# EAGLE design board (EAGLE 6.5.0)
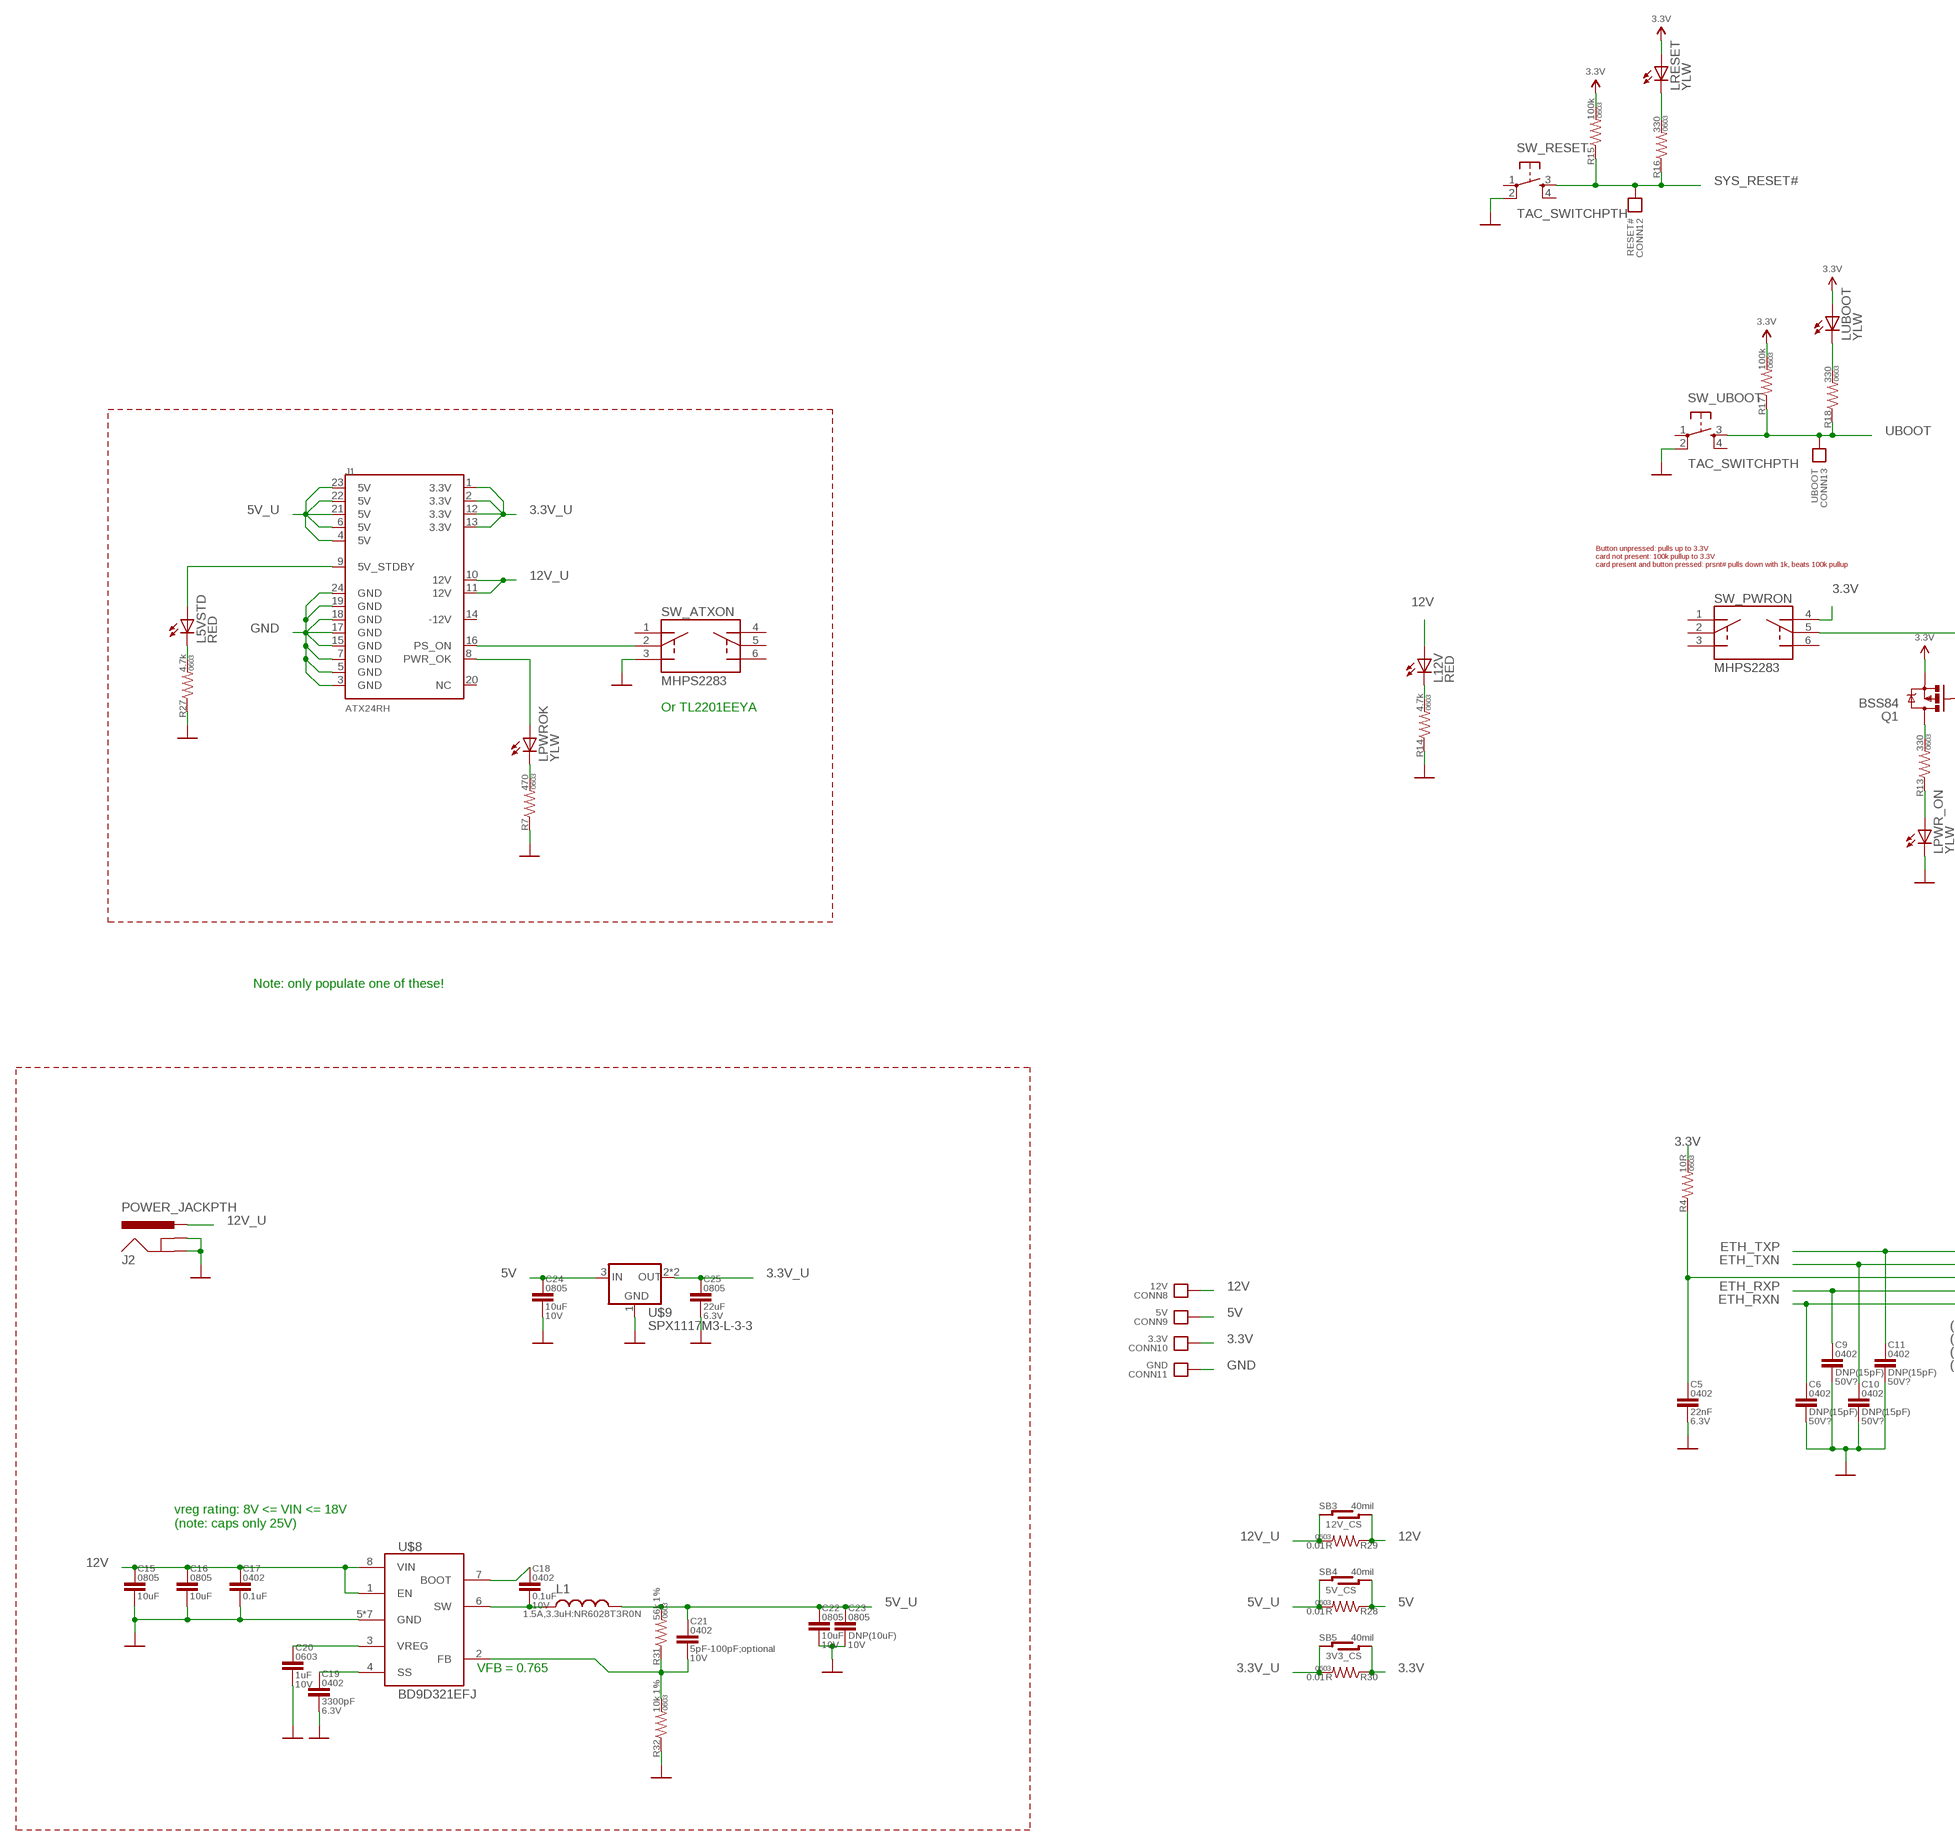
[diagram p0: schematic, sheet 1, part 1 of 2]
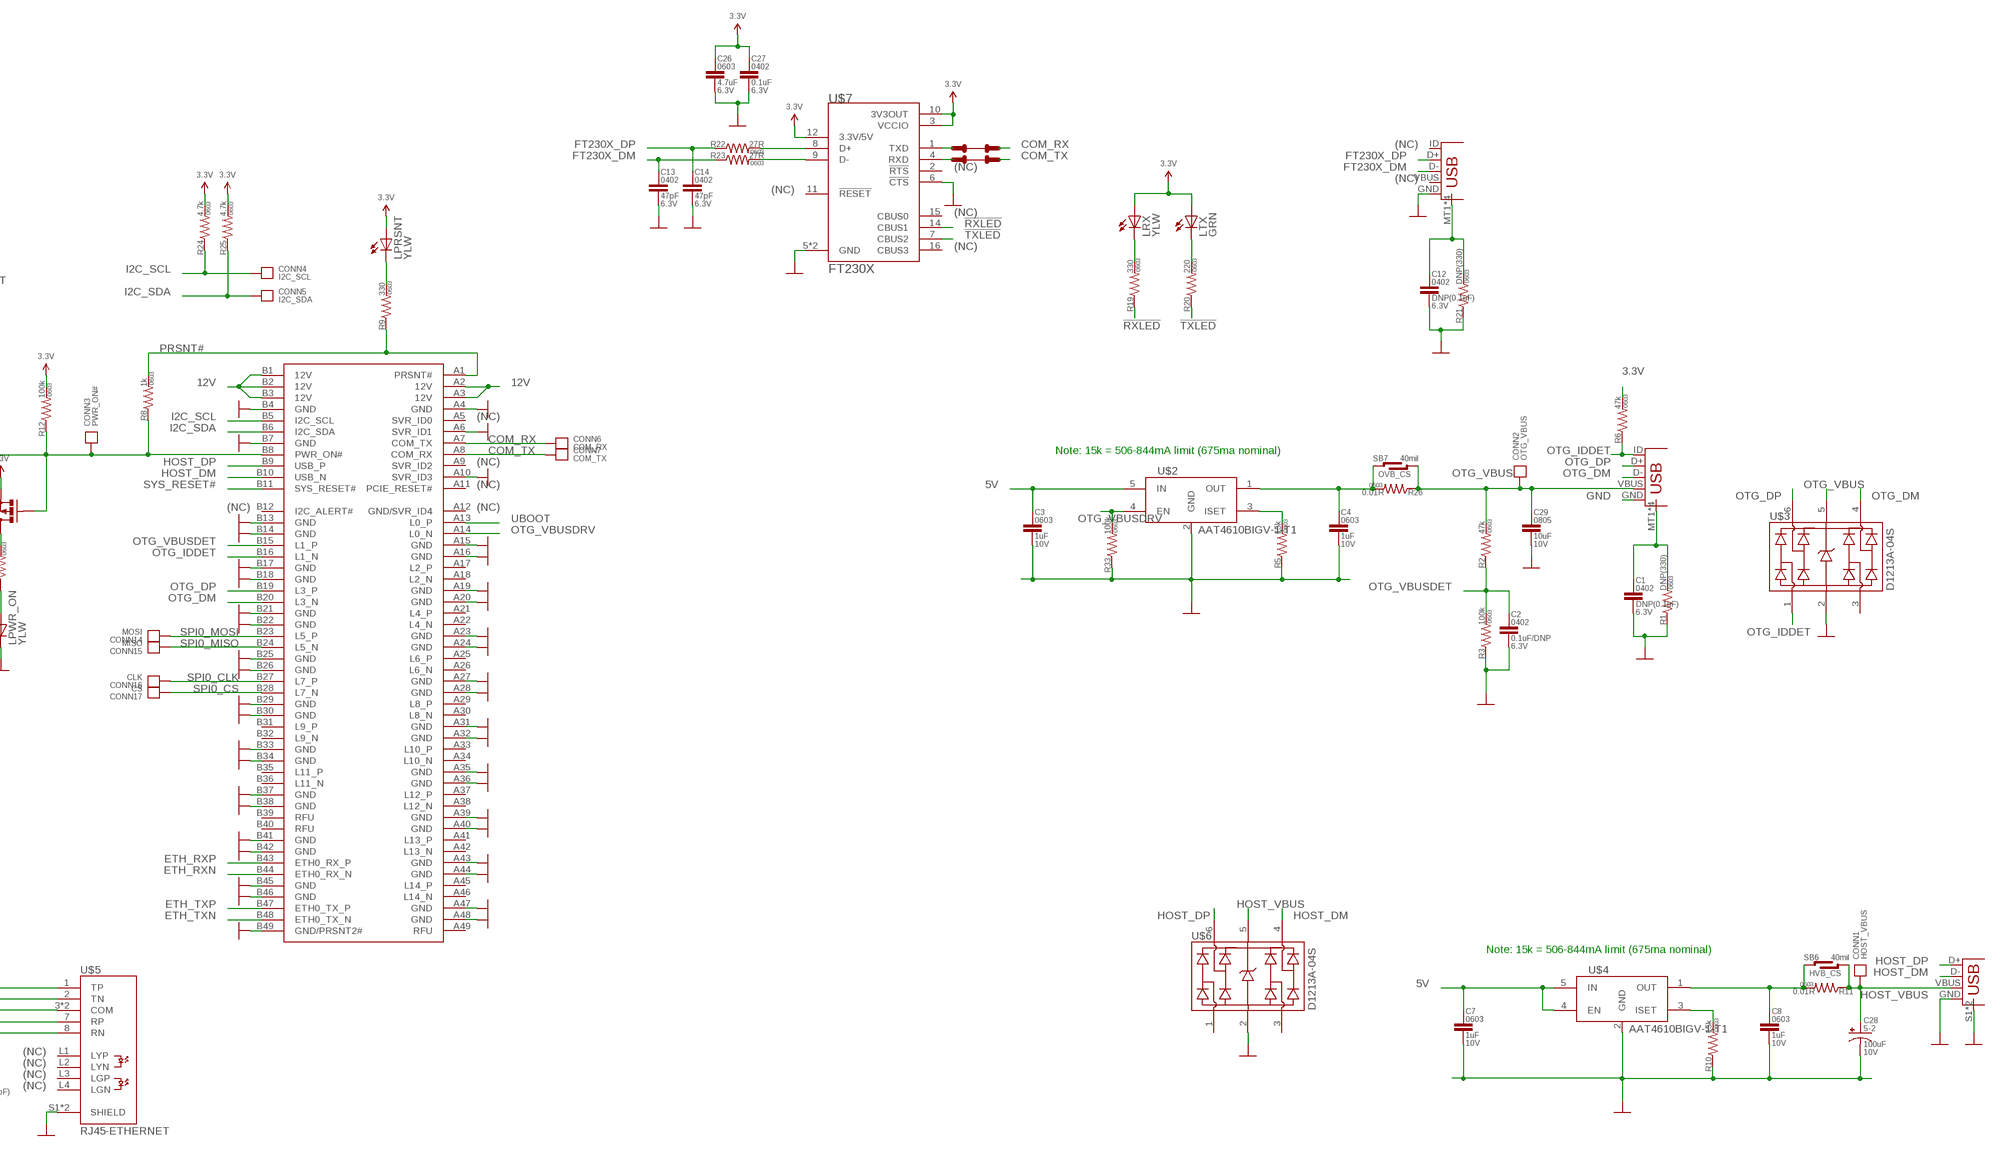
[diagram p1: schematic, sheet 1, part 2 of 2]

## Parts
C1  DNP(0.1uF)  CAP0402-CAP  [0402-CAP]
C2  0.1uF/DNP  CAP0402-CAP  [0402-CAP]
C3  1uF  CAP0603  [0603-CAP]
C4  1uF  CAP0603  [0603-CAP]
C5  22nF  CAP0402-CAP  [0402-CAP]
C6  DNP(15pF)  CAP0402-CAP  [0402-CAP]
C7  1uF  CAP0603  [0603-CAP]
C8  1uF  CAP0603  [0603-CAP]
C9  DNP(15pF)  CAP0402-CAP  [0402-CAP]
C10  DNP(15pF)  CAP0402-CAP  [0402-CAP]
C11  DNP(15pF)  CAP0402-CAP  [0402-CAP]
C12  DNP(0.1uF)  CAP0402-CAP  [0402-CAP]
C13  47pF  CAP0402-CAP  [0402-CAP]
C14  47pF  CAP0402-CAP  [0402-CAP]
C15  10uF  CAP0805  [0805]
C16  10uF  CAP0805  [0805]
C17  0.1uF  CAP0402-CAP  [0402-CAP]
C18  0.1uF  CAP0402-CAP  [0402-CAP]
C19  3300pF  CAP0402-CAP  [0402-CAP]
C20  1uF  CAP0603  [0603-CAP]
C21  5pF-100pF;optional  CAP0402-CAP  [0402-CAP]
C22  10uF  CAP0805  [0805]
C23  DNP(10uF)  CAP0805  [0805]
C24  10uF  CAP0805  [0805]
C25  22uF  CAP0805  [0805]
C26  4.7uF  CAP0603  [0603-CAP]
C27  0.1uF  CAP0402-CAP  [0402-CAP]
C28  100uF  CAP_POLPTH-5-2  [CAP-5-2]
C29  10uF  CAP0805  [0805]
CONN1  HOST_VBUS  CONNECTOR22AWG  [HOLE_22AWG]
CONN2  OTG_VBUS  CONNECTOR22AWG  [HOLE_22AWG]
CONN3  PWR_ON#  CONNECTOR22AWG  [HOLE_22AWG]
CONN4  I2C_SCL  CONNECTOR22AWG  [HOLE_22AWG]
CONN5  I2C_SDA  CONNECTOR22AWG  [HOLE_22AWG]
CONN6  COM_RX  CONNECTOR22AWG  [HOLE_22AWG]
CONN7  COM_TX  CONNECTOR22AWG  [HOLE_22AWG]
CONN8  12V  CONNECTOR22AWG  [HOLE_22AWG]
CONN9  5V  CONNECTOR22AWG  [HOLE_22AWG]
CONN10  3.3V  CONNECTOR22AWG  [HOLE_22AWG]
CONN11  GND  CONNECTOR22AWG  [HOLE_22AWG]
CONN12  RESET#  CONNECTOR22AWG  [HOLE_22AWG]
CONN13  UBOOT  CONNECTOR22AWG  [HOLE_22AWG]
CONN14  MOSI  CONNECTOR22AWG  [HOLE_22AWG]
CONN15  MISO  CONNECTOR22AWG  [HOLE_22AWG]
CONN16  CLK  CONNECTOR22AWG  [HOLE_22AWG]
CONN17  CS  CONNECTOR22AWG  [HOLE_22AWG]
J1  ATX24RH  [ATX24_RIGHT_ANGLE]
J2  POWER_JACKPTH  [POWER_JACK_PTH]
JP1  USB-IDMICRO  [USB-MICRO]
JP2  USB-IDMICRO  [USB-MICRO]
JP3  USBA-FEMALE-TH  [USB-A-SOCKET-TH]
L1  1.5A,3.3uH:NR6028T3R0N  INDUCTORNR60XX  [NR60XX]
L5VSTD  RED  LED0603  [0603_LED]
L12V  RED  LED0603  [0603_LED]
LPRSNT  YLW  LED0603  [0603_LED]
LPWR_ON  YLW  LED0603  [0603_LED]
LPWROK  YLW  LED0603  [0603_LED]
LRESET  YLW  LED0603  [0603_LED]
LRX  YLW  LED0603  [0603_LED]
LTX  GRN  LED0603  [0603_LED]
LUBOOT  YLW  LED0603  [0603_LED]
Q1  BSS84  MOSFET-PCHANNELSMD  [SOT23-3]
R1  DNP(330)  RESISTOR0603  [0603-RES]
R2  47k  RESISTOR0603  [0603-RES]
R3  100k  RESISTOR0603  [0603-RES]
R4  10R  RESISTOR0603  [0603-RES]
R5  15k  RESISTOR0603  [0603-RES]
R6  47k  RESISTOR0603  [0603-RES]
R7  470  RESISTOR0603  [0603-RES]
R8  1k  RESISTOR0603  [0603-RES]
R9  330  RESISTOR0603  [0603-RES]
R10  15k  RESISTOR0603  [0603-RES]
R11  0.01R  RESISTOR0603  [0603-RES]
R12  100k  RESISTOR0603  [0603-RES]
R13  330  RESISTOR0603  [0603-RES]
R14  4.7k  RESISTOR0603  [0603-RES]
R15  100k  RESISTOR0603  [0603-RES]
R16  330  RESISTOR0603  [0603-RES]
R17  100k  RESISTOR0603  [0603-RES]
R18  330  RESISTOR0603  [0603-RES]
R19  330  RESISTOR0603  [0603-RES]
R20  220  RESISTOR0603  [0603-RES]
R21  DNP(330)  RESISTOR0603  [0603-RES]
R22  27R  RESISTOR0603  [0603-RES]
R23  27R  RESISTOR0603  [0603-RES]
R24  4.7k  RESISTOR0603  [0603-RES]
R25  4.7k  RESISTOR0603  [0603-RES]
R26  0.01R  RESISTOR0603  [0603-RES]
R27  4.7k  RESISTOR0603  [0603-RES]
R28  0.01R  RESISTOR0603  [0603-RES]
R29  0.01R  RESISTOR0603  [0603-RES]
R30  0.01R  RESISTOR0603  [0603-RES]
R31  56k 1%  RESISTOR0603  [0603-RES]
R32  10k 1%  RESISTOR0603  [0603-RES]
R33  100k  RESISTOR0603  [0603-RES]
SB1  RX  TRACE-CUT  [TRACE-CUT]
SB2  TX  TRACE-CUT  [TRACE-CUT]
SB3  12V_CS  SOLDER-BRIDGEOPEN-WIDE  [SOLDER-BRIDGE-OPEN-LARGE]
SB4  5V_CS  SOLDER-BRIDGEOPEN-WIDE  [SOLDER-BRIDGE-OPEN-LARGE]
SB5  3V3_CS  SOLDER-BRIDGEOPEN-WIDE  [SOLDER-BRIDGE-OPEN-LARGE]
SB6  HVB_CS  SOLDER-BRIDGEOPEN-WIDE  [SOLDER-BRIDGE-OPEN-LARGE]
SB7  OVB_CS  SOLDER-BRIDGEOPEN-WIDE  [SOLDER-BRIDGE-OPEN-LARGE]
SW_ATXON  MHPS2283  SWITCH_DPDTPUSHBUTTON  [PUSHBUTTON-2.5-5.4]
SW_PWRON  MHPS2283  SWITCH_DPDTPUSHBUTTON  [PUSHBUTTON-2.5-5.4]
SW_RESET  TAC_SWITCHPTH  [TACTILE-PTH]
SW_UBOOT  TAC_SWITCHPTH  [TACTILE-PTH]
U$1  CVN-V1CONN  [CVN-V1-CONN]
U$2  AAT4610BIGV-1-T1  LOAD_SWITCH_ILIMIT  [SOT23-5]
U$3  D1213A-04S  TVS_ARRAY  [SOT363]
U$4  AAT4610BIGV-1-T1  LOAD_SWITCH_ILIMIT  [SOT23-5]
U$5  RJ45-ETHERNET  [RJ45]
U$6  D1213A-04S  TVS_ARRAY  [SOT363]
U$7  FT230X  [TSSOP16]
U$8  BD9D321EFJ  [HTSOP8]
U$9  SPX1117M3-L-3-3  VREGSOT223  [SOT223]

## Nets
3.3V: C26.1 C27.1 CONN10.P LPRSNT.A LRESET.A LRX.A LTX.A LUBOOT.A Q1.2(S) R4.2 R6.2 R12.2 R15.2 R17.2 R24.2 R25.2 R30.1 SB5.R1 SB5.R2 SW_PWRON.4(NC1) U$7.3(VCCIO) U$7.10(3V3OUT) U$7.12(3.3V/5V)
3.3V_U: C25.1 J1.1(3.3V) J1.2(3.3V) J1.12(3.3V) J1.13(3.3V) R30.2 SB5.L1 SB5.L2 U$9.2(OUT) U$9.4(OUT)
5V: C3.1 C7.1 C24.1 CONN9.P R28.1 SB4.R1 SB4.R2 U$2.5(IN) U$4.4(EN) U$4.5(IN) U$9.3(IN)
5V_U: C21.1 C22.1 C23.1 J1.4(5V) J1.6(5V) J1.21(5V) J1.22(5V) J1.23(5V) L1.P$2 R28.2 R31.2 SB4.L1 SB4.L2
12V: C15.1 C16.1 C17.1 CONN8.P L12V.A R29.1 SB3.R1 SB3.R2 U$1.A2(12V) U$1.A3(12V) U$1.B1(12V) U$1.B2(12V) U$1.B3(12V) U$8.1(EN) U$8.8(VIN)
12V_U: J1.10(12V) J1.11(12V) J2.PWR R29.2 SB3.L1 SB3.L2
!RXLED: R19.1 U$7.14(CBUS1)
!TXLED: R20.1 U$7.7(CBUS2)
COM_RX: CONN6.P SB1.R1 U$1.A7(COM_TX)
COM_TX: CONN7.P SB2.R1 U$1.A8(COM_RX)
ETH_RXN: C6.1 U$1.B44(ETH0_RX_N) U$5.8(RN)
ETH_RXP: C9.1 U$1.B43(ETH0_RX_P) U$5.7(RP)
ETH_TXN: C10.1 U$1.B48(ETH0_TX_N) U$5.2(TN)
ETH_TXP: C11.1 U$1.B47(ETH0_TX_P) U$5.1(TP)
FT230X_DM: C13.1 JP2.D- R23.1
FT230X_DP: C14.1 JP2.D+ R22.1
GND: C1.2 C2.2 C3.2 C4.2 C5.2 C6.2 C7.2 C8.2 C9.2 C10.2 C11.2 C12.2 C13.2 C14.2 C15.2 C16.2 C17.2 C19.2 C20.2 C22.2 C23.2 C24.2 C25.2 C26.2 C27.2 C28.2(-) C29.2 CONN11.P J1.3(GND) J1.5(GND) J1.7(GND) J1.15(GND) J1.17(GND) J1.18(GND) J1.19(GND) J1.24(GND) J2.GND J2.GNDBREAK JP1.GND JP2.GND JP3.GND JP3.S1(SHELL) JP3.S2(SHELL) LPWR_ON.C R1.1 R3.1 R5.1 R7.1 R10.1 R14.1 R21.1 R27.1 R32.1 R33.1 SW_ATXON.3(NO0) SW_RESET.2 SW_UBOOT.2 U$1.A4(GND) U$1.A6(SVR_ID1) U$1.A10(SVR_ID3) U$1.A15(GND) U$1.A16(GND) U$1.A19(GND) U$1.A20(GND) U$1.A23(GND) U$1.A24(GND) U$1.A27(GND) U$1.A28(GND) U$1.A31(GND) U$1.A32(GND) U$1.A35(GND) U$1.A36(GND) U$1.A39(GND) U$1.A40(GND) U$1.A43(GND) U$1.A44(GND) U$1.A47(GND) U$1.A48(GND) U$1.B4(GND) U$1.B7(GND) U$1.B13(GND) U$1.B14(GND) U$1.B17(GND) U$1.B18(GND) U$1.B21(GND) U$1.B22(GND) U$1.B25(GND) U$1.B26(GND) U$1.B29(GND) U$1.B30(GND) U$1.B33(GND) U$1.B34(GND) U$1.B37(GND) U$1.B38(GND) U$1.B41(GND) U$1.B42(GND) U$1.B45(GND) U$1.B46(GND) U$1.B49(GND/PRSNT2#) U$2.2(GND) U$3.2(VN) U$4.2(GND) U$5.S1(SHIELD) U$5.S2(SHIELD) U$6.2(VN) U$7.5(GND) U$7.6(!CTS) U$7.13(GND) U$8.5(GND) U$8.P$1(GND) U$8.P$2(GND) U$8.P$3(GND) U$8.P$4(GND) U$8.P$5(GND) U$8.PAD(GND) U$9.1(GND)
HOST_DM: JP3.D- U$1.B10(USB_N) U$6.4(CH3)
HOST_DP: JP3.D+ U$1.B9(USB_P) U$6.6(CH4)
HOST_VBUS: C28.1(+) CONN1.P JP3.VBUS R11.1 SB6.R1 SB6.R2 U$6.5(VP)
HOST_VBUS_U: C8.1 R11.2 SB6.L1 SB6.L2 U$4.1(OUT)
I2C_SCL: CONN4.P R24.1 U$1.B5(I2C_SCL)
I2C_SDA: CONN5.P R25.1 U$1.B6(I2C_SDA)
N$1: J1.16(PS_ON) SW_ATXON.2(COM0)
N$2: J1.8(PWR_OK) LPWROK.A
N$3: C1.1 JP1.MT1(SHELL) JP1.MT2(SHELL) JP1.P$1(SHELL) JP1.P$2(SHELL) R1.2
N$4: C5.1 R4.1 U$5.3(COM) U$5.6(COM)
N$6: R5.2 U$2.3(ISET)
N$8: Q1.3(D) R13.2
N$9: LPWROK.C R7.2
N$10: LRX.C R19.2
N$11: LTX.C R20.2
N$12: R10.2 U$4.3(ISET)
N$14: LPRSNT.C R9.2
N$15: LPWR_ON.A R13.1
N$16: LRESET.C R16.2
N$17: L12V.C R14.2
N$18: LUBOOT.C R18.2
N$19: R23.2 U$7.9(D-)
N$20: C12.1 JP2.MT1(SHELL) JP2.MT2(SHELL) JP2.P$1(SHELL) JP2.P$2(SHELL) R21.2
N$21: SB1.L1 U$7.1(TXD)
N$22: SB2.L1 U$7.4(RXD)
N$23: R22.2 U$7.8(D+)
N$24: L5VSTD.C R27.2
N$25: J1.9(5V_STDBY) L5VSTD.A
N$26: C18.1 U$8.7(BOOT)
N$27: C18.2 L1.P$1 U$8.6(SW)
N$28: C20.1 U$8.3(VREG)
N$29: C19.1 U$8.4(SS)
N$30: C21.2 R31.1 R32.2 U$8.2(FB)
OTG_DM: JP1.D- U$1.B20(L3_N) U$3.4(CH3)
OTG_DP: JP1.D+ U$1.B19(L3_P) U$3.6(CH4)
OTG_IDDET: JP1.ID R6.1 U$1.B16(L1_N) U$3.1(CH1)
OTG_VBUS: C29.1 CONN2.P JP1.VBUS R2.2 R26.1 SB7.R1 SB7.R2 U$3.5(VP)
OTG_VBUS_U: C4.1 R26.2 SB7.L1 SB7.L2 U$2.1(OUT)
OTG_VBUSDET: C2.1 R2.1 R3.2 U$1.B15(L1_P)
OTG_VBUSDRV: R33.2 U$1.A14(L0_N) U$2.4(EN)
PRSNT#: R8.2 R9.1 U$1.A1(PRSNT#)
PWR_ON#: CONN3.P Q1.1(G) R8.1 R12.1 SW_PWRON.5(COM1) U$1.B8(PWR_ON#)
SPI0_CLK: CONN16.P U$1.B27(L7_P)
SPI0_CS: CONN17.P U$1.B28(L7_N)
SPI0_MISO: CONN15.P U$1.B24(L5_N)
SPI0_MOSI: CONN14.P U$1.B23(L5_P)
SYS_RESET#: CONN12.P R15.1 R16.1 SW_RESET.3 U$1.B11(SYS_RESET#)
UBOOT: CONN13.P R17.1 R18.1 SW_UBOOT.3 U$1.A13(L0_P)
Unconnected: J1.14(-12V) J1.20(NC) JP2.ID JP2.VBUS SW_ATXON.1(NC0) SW_ATXON.4(NC1) SW_ATXON.5(COM1) SW_ATXON.6(NO1) SW_PWRON.1(NC0) SW_PWRON.2(COM0) SW_PWRON.3(NO0) SW_PWRON.6(NO1) SW_RESET.1 SW_RESET.4 SW_UBOOT.1 SW_UBOOT.4 U$1.A5(SVR_ID0) U$1.A9(SVR_ID2) U$1.A11(PCIE_RESET#) U$1.A12(GND/SVR_ID4) U$1.A17(L2_P) U$1.A18(L2_N) U$1.A21(L4_P) U$1.A22(L4_N) U$1.A25(L6_P) U$1.A26(L6_N) U$1.A29(L8_P) U$1.A30(L8_N) U$1.A33(L10_P) U$1.A34(L10_N) U$1.A37(L12_P) U$1.A38(L12_N) U$1.A41(L13_P) U$1.A42(L13_N) U$1.A45(L14_P) U$1.A46(L14_N) U$1.A49(RFU) U$1.B12(I2C_ALERT#) U$1.B31(L9_P) U$1.B32(L9_N) U$1.B35(L11_P) U$1.B36(L11_N) U$1.B39(RFU) U$1.B40(RFU) U$3.3(CH2) U$5.L1(LYP) U$5.L2(LYN) U$5.L3(LGP) U$5.L4(LGN) U$6.1(CH1) U$6.3(CH2) U$7.2(!RTS) U$7.11(!RESET) U$7.15(CBUS0) U$7.16(CBUS3)

## Notes on the sheet
- (NC)
- (NC)
- (NC)
- (NC)
- (NC)
- (NC)
- Button unpressed: pulls up to 3.3V
  card not present: 100k pullup to 3.3V
  card present and button pressed: prsnt# pulls down with 1k, beats 100k pullup
- (NC)
- Note: 15k = 506-844mA limit (675ma nominal)
- (NC)
- (NC)
- (NC) | (NC)
- Or TL2201EEYA
- Note: only populate one of these!
- Note: 15k = 506-844mA limit (675ma nominal)
- (NC)
- (NC)
- (NC)
- (NC)
- vreg rating: 8V <= VIN <= 18V
  (note: caps only 25V)
- VFB = 0.765

## Library data of the parts
C1 C2 C5 C12-C14 C19 C27 = kmod-passives:CAP: Capacitor Standard 0603 ceramic capacitor, and 0.1" leaded capacitor.; PACKAGE: 0402; VOLTAGE: 6.3V
C3 C4 C7 C8 C20 = kmod-passives:CAP: Capacitor Standard 0603 ceramic capacitor, and 0.1" leaded capacitor.; PACKAGE: 0603; VOLTAGE: 10V
C6 C9-C11 = kmod-passives:CAP: Capacitor Standard 0603 ceramic capacitor, and 0.1" leaded capacitor.; PACKAGE: 0402; VOLTAGE: 50V?
C15 C16 = kmod-passives:CAP: Capacitor Standard 0603 ceramic capacitor, and 0.1" leaded capacitor.; PACKAGE: 0805; VOLTAGE: 25V
C17 = kmod-passives:CAP: Capacitor Standard 0603 ceramic capacitor, and 0.1" leaded capacitor.; PACKAGE: 0402; VOLTAGE: 25V
C18 C21 = kmod-passives:CAP: Capacitor Standard 0603 ceramic capacitor, and 0.1" leaded capacitor.; PACKAGE: 0402; VOLTAGE: 10V
C22-C24 C29 = kmod-passives:CAP: Capacitor Standard 0603 ceramic capacitor, and 0.1" leaded capacitor.; PACKAGE: 0805; VOLTAGE: 10V
C25 = kmod-passives:CAP: Capacitor Standard 0603 ceramic capacitor, and 0.1" leaded capacitor.; PACKAGE: 0805; VOLTAGE: 6.3V
C26 = kmod-passives:CAP: Capacitor Standard 0603 ceramic capacitor, and 0.1" leaded capacitor.; PACKAGE: 0603; VOLTAGE: 6.3V
C28 = kmod-passives:CAP_POL: Capacitor Polarized These are standard SMD and PTH capacitors. Normally 10uF, 47uF, and 100uF in electrolytic and tantalum varieties. Always verify the external diameter of the through hole cap, it varies with capacity, voltage, and manufacturer. The EIA devices should be standard.; PACKAGE: 5-2; VOLTAGE: 10V
CONN1-CONN17 = kmod-nonparts:CONNECTOR: Collection of holes/pads for testing/connecting
J1 = SparkFun-Connectors:ATX24: ATX24 Pin Power Supply Connector This is a good connector for connecting a computer power supply to a PCB. It's massive, but provides many amps of power at 5V and 12V. SKU: PRT-09498
J2 = SparkFun-Connectors:POWER_JACK: Power Jack This is the standard 5.5mm barrel jack for power. The PTH is the most common, proven, reliable, footprint. The Slot footprint only works if the mill layer is transmitted to the PCB fab house so be warned. Mating wall wart : TOL-00298 (and others); PROD_ID: PRT-00119
JP1 JP2 = kmod-connectors:USB-ID: USB Connectors Got from SparkFun, removed all but MICROB. Used that successfully. no mounting holes - I think this footprint will work for micro-A/B/AB connectors. haven't tested it yet on anything other than B.; PROD_ID: CONN-09505
JP3 = kmod-connectors:USB: USB Connectors Got from SparkFun, removed all but MICROB. Used that successfully. no mounting holes - I think this footprint will work for micro-A/B/AB connectors. haven't tested it yet on anything other than B.
L1 = kmod-passives:INDUCTOR
L5VSTD L12V LPRSNT LPWR_ON LPWROK LRESET LRX LTX LUBOOT = kmod-passives:LED
Q1 = SparkFun-DiscreteSemi:MOSFET-PCHANNEL: Generic PMOSFET IRLML2244 - TRANS-11153 (SOT-23 -20V -4.3A) (1.Gate 2.Source 3.Drain) FQP27P06 - COM-10349 <http://www.sparkfun.com/products/10349> (TO-220 -60V -27A) (1.Gate 2.Source 3.Drain)
R1-R33 = kmod-passives:RESISTOR: Resistor Basic schematic elements and footprints for 0603, 1206, and PTH resistors.; PACKAGE: 0603
SB1 SB2 = kmod-nonparts:TRACE-CUT
SB3-SB7 = kmod-nonparts:SOLDER-BRIDGE; PACKAGE: 40mil
SW_ATXON SW_PWRON = kmod-mechanical:SWITCH_DPDT
SW_RESET SW_UBOOT = kmod-mechanical:TAC_SWITCH: Momentary Switch Button commonly used for reset or general input. Spark Fun Electronics SKU : COM-00097 SMT- SWCH-08247
U$1 = kmod-connectors:CVN-V1
U$2 U$4 = kmod-ics:LOAD_SWITCH_ILIMIT: Current-limited high-side load switch Such as for USB vbus. Note: active-high enable.
U$3 U$6 = kmod-discretesemi:TVS_ARRAY: Based off the Diodes Inc D1213A-04S http://www.diodes.com/datasheets/D1213A-04S.pdf
U$5 = kmod-connectors:RJ45-ETHERNET
U$7 = kmod-ics:FT230X: FTDI USB-UART bridge
U$8 = kmod-testing:BD9D321
U$9 = kmod-ics:VREG

## Board
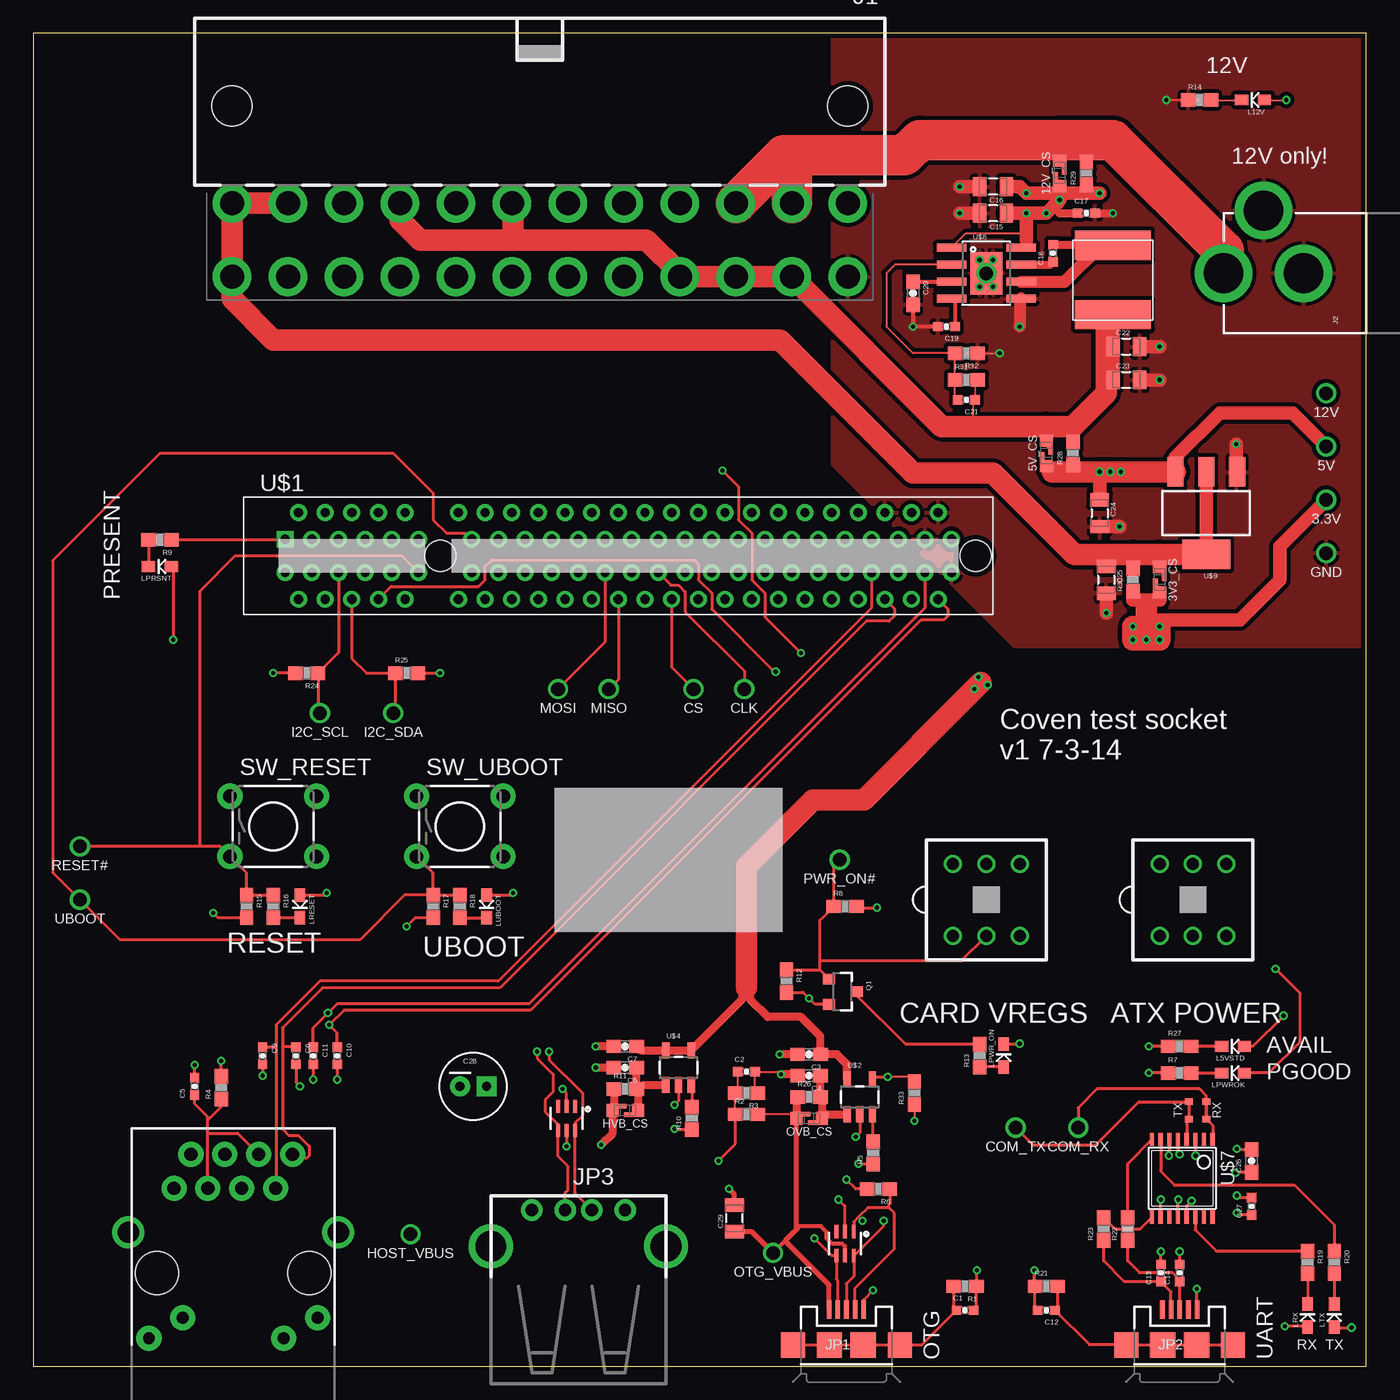
[diagram p2: board, top side]
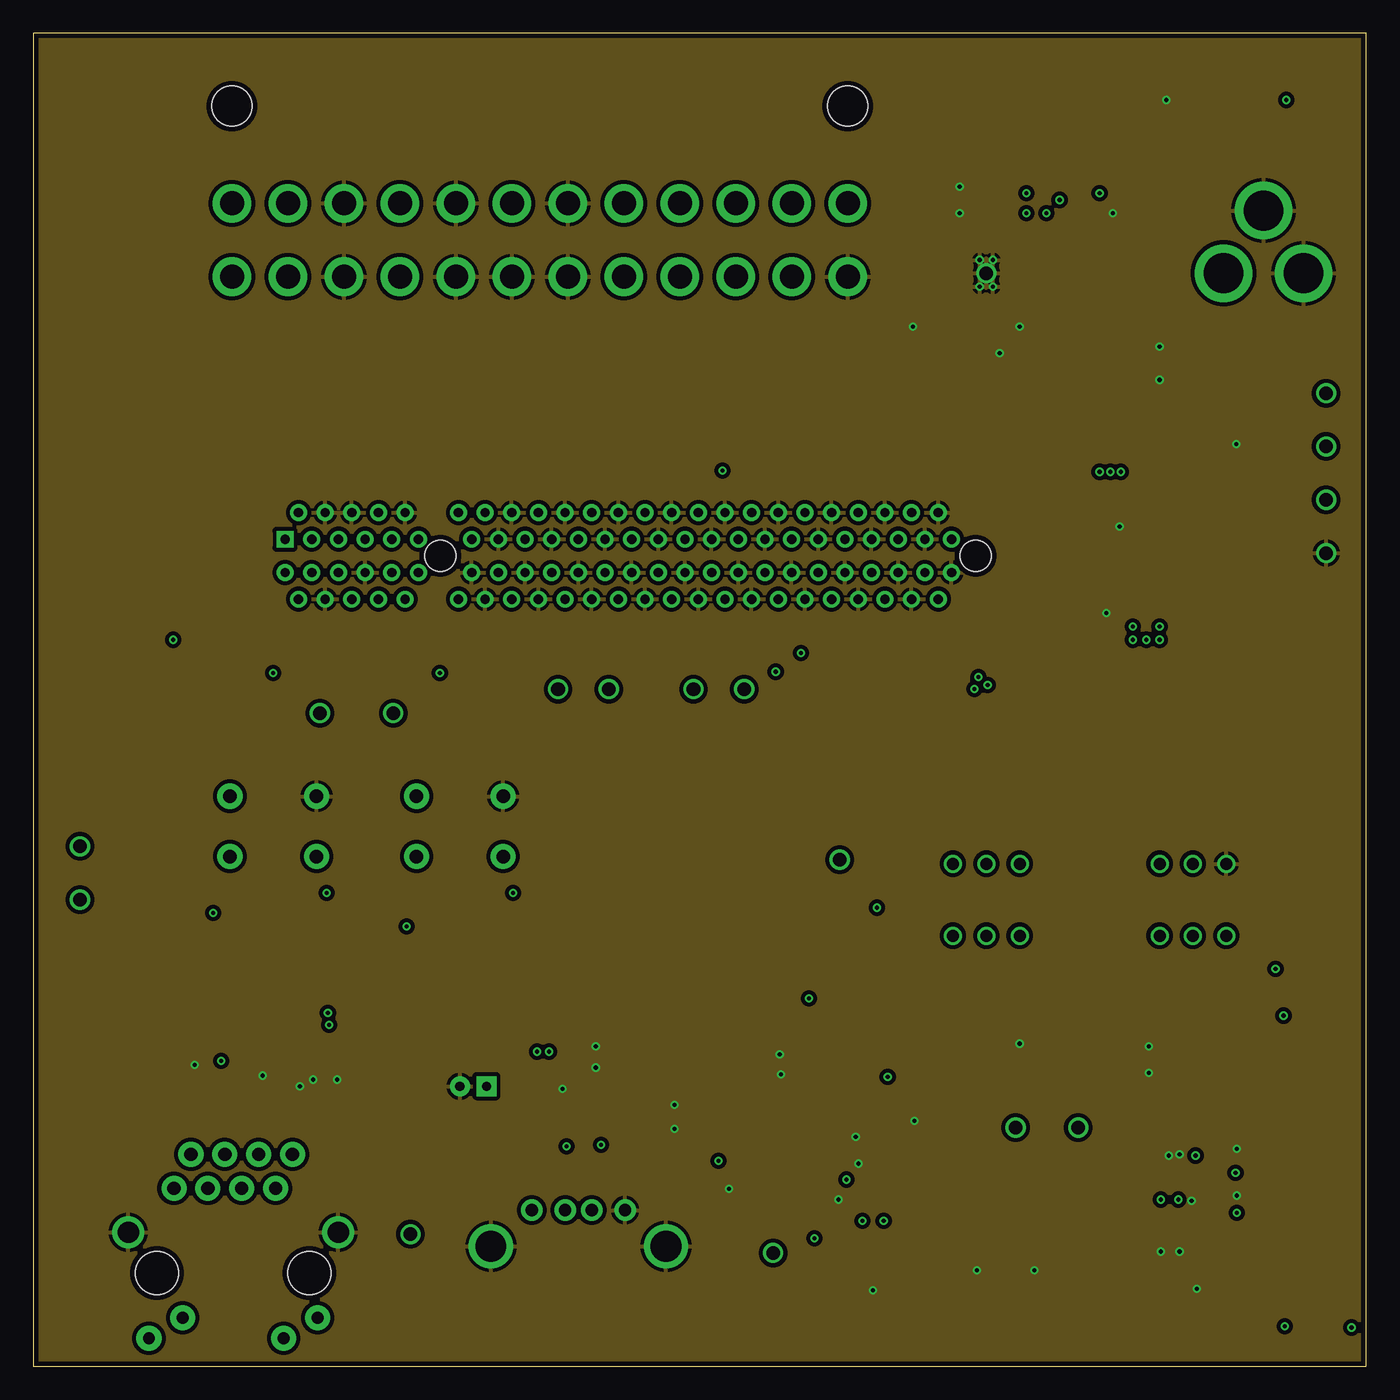
[diagram p3: board, inner layer Route2]
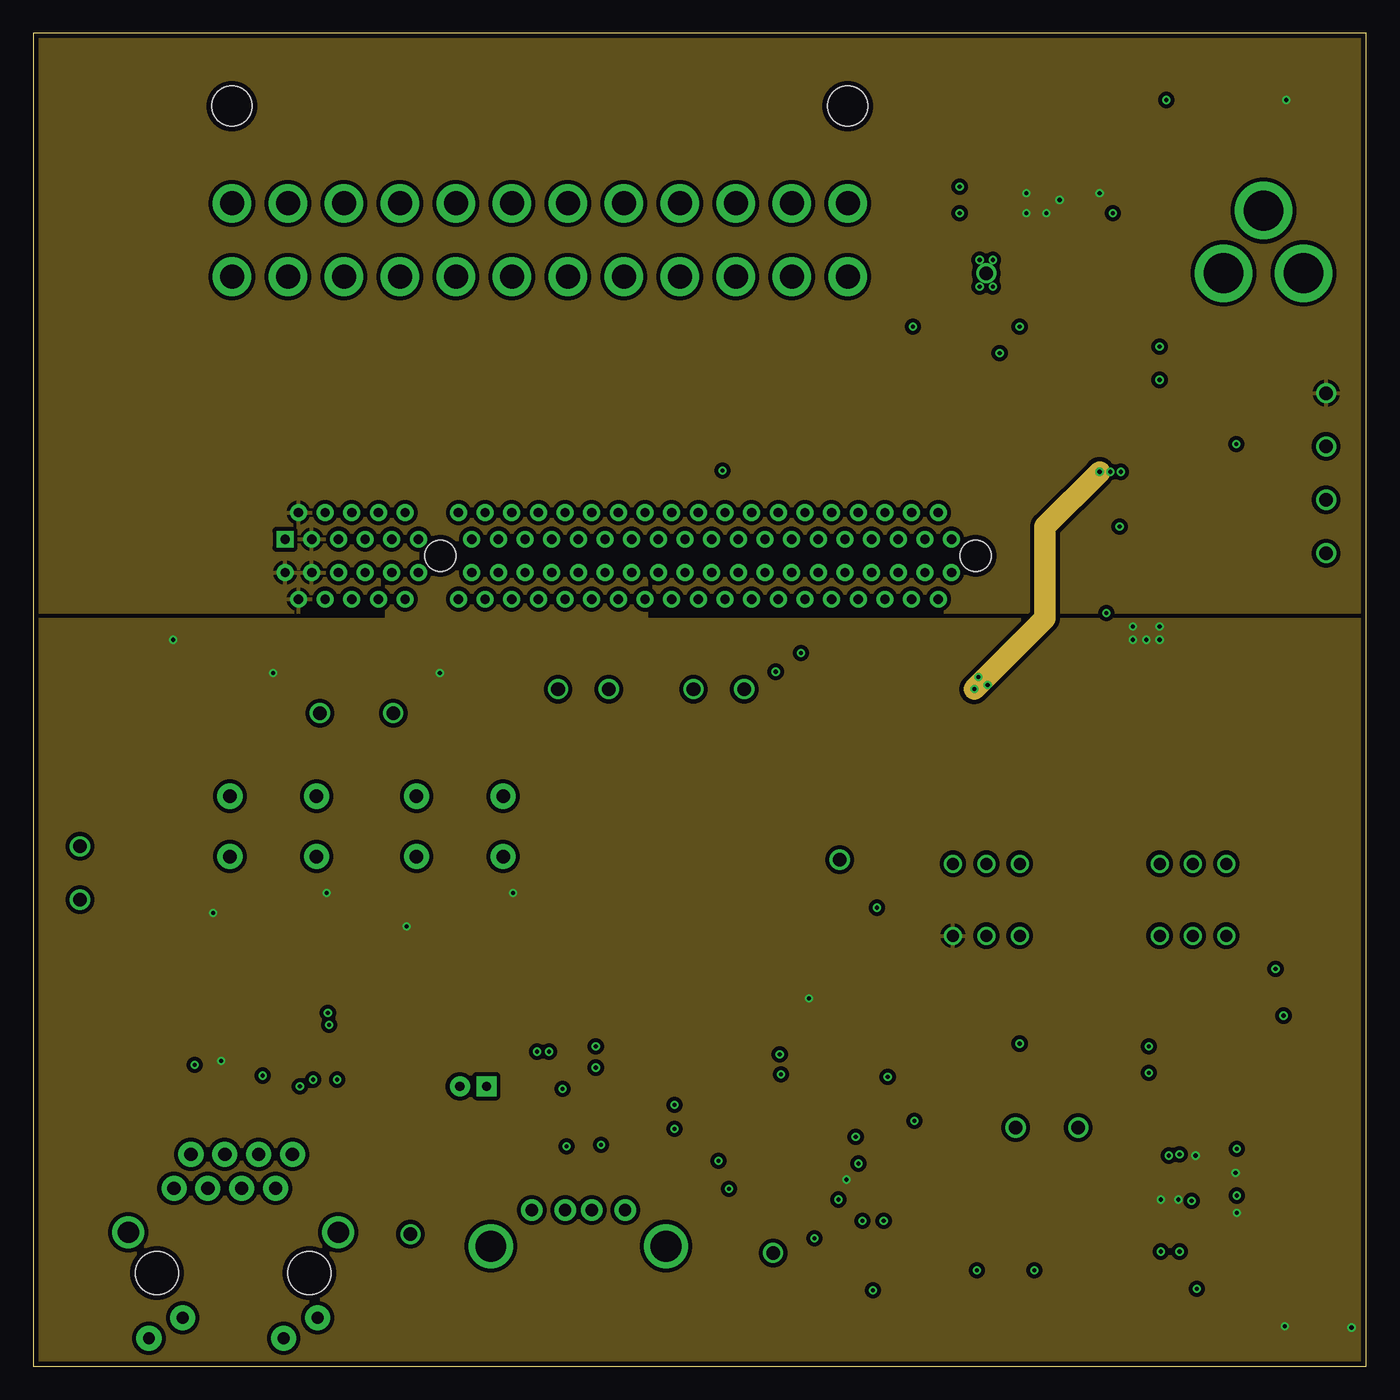
[diagram p4: board, inner layer Route15]
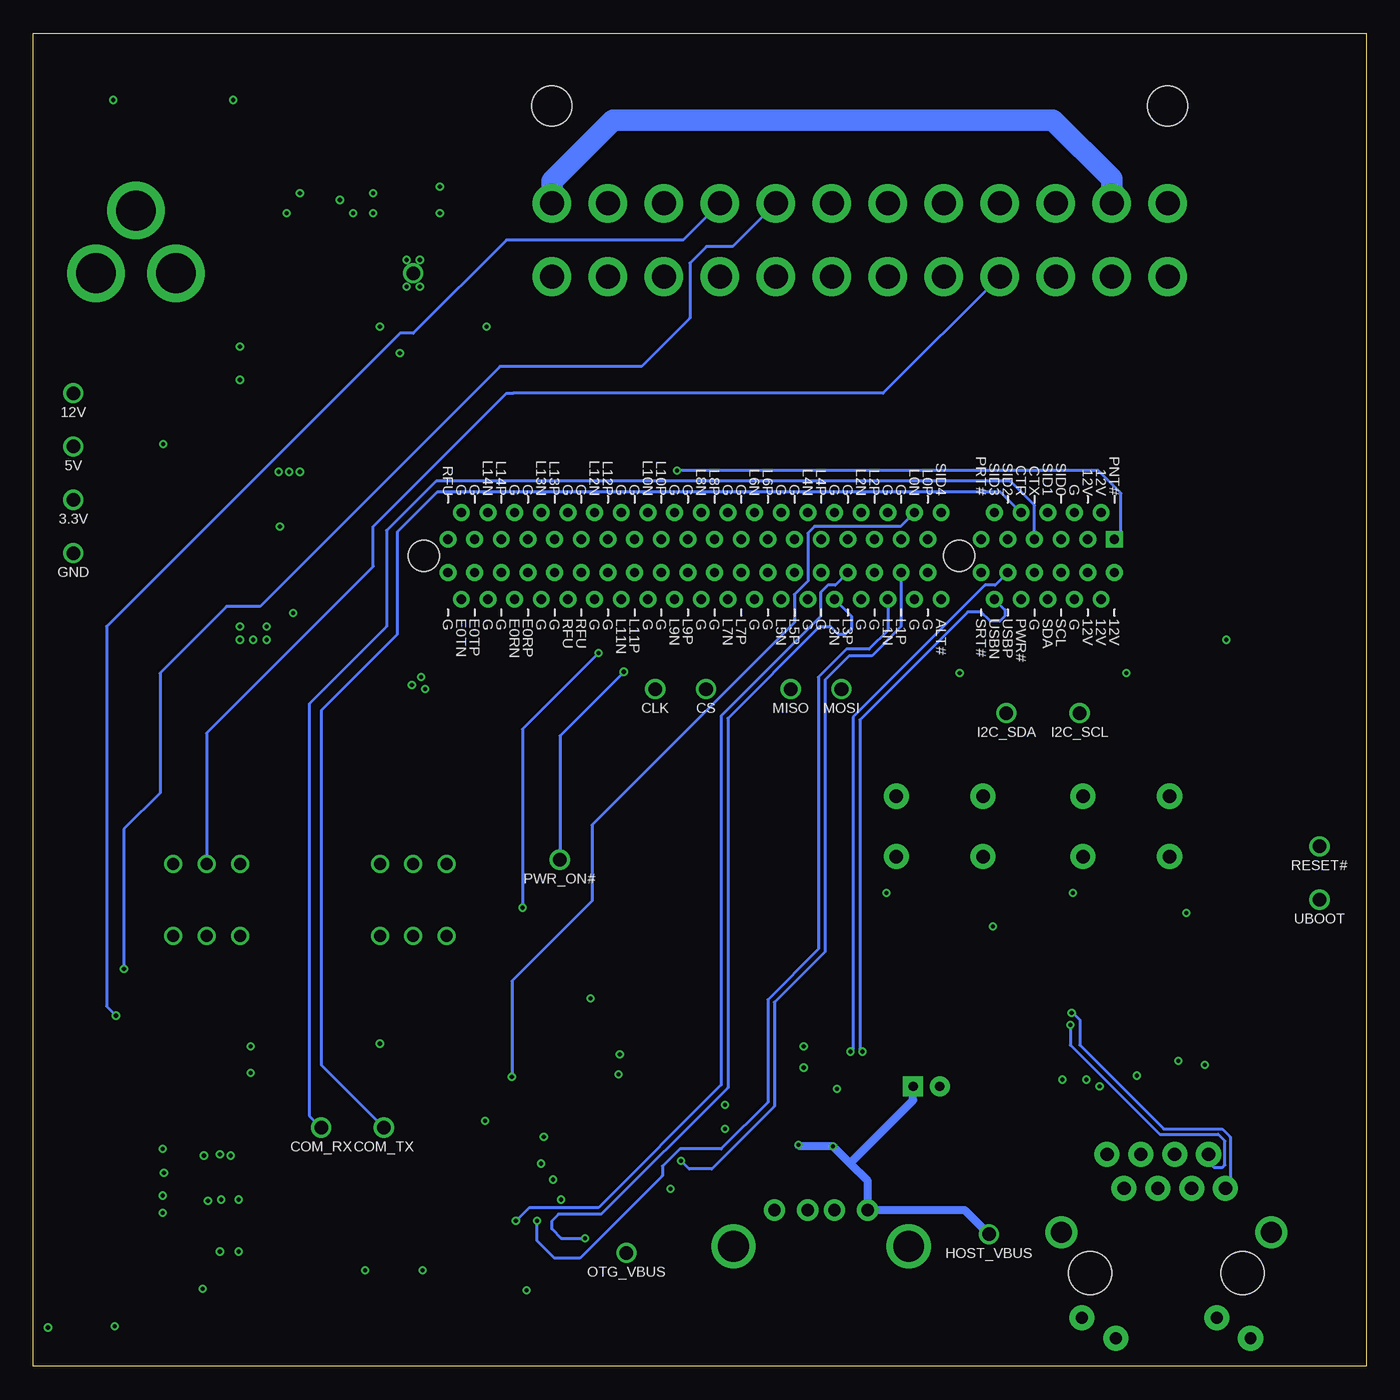
[diagram p5: board, bottom side, seen from below]

Size 100 x 100 mm. Coordinates in mm from the lower left corner, seen from the top.
Outline: 0,0 100,0 100,100 0,100 0,0
Copper layers (1*2*15*16): Top 0.035mm / dielectric 0.2mm / Route2 0.0175mm / dielectric 0.3mm / Route15 0.0175mm / dielectric 0.2mm / Bottom 0.035mm
Design rules "my_SeeedStudio_4layer_DRU_no_angle_20140221": minimum track width 6mil, minimum drill 12mil, track to track 6mil, track to pad 6mil, pad to pad 6mil, via to via 6mil, smd to smd 6mil, copper to edge 15mil, drill to drill 10mil, minimum pad ring 6mil, minimum via ring 6mil, stop-mask expansion 2mil, vias tented up to drill 12mil, thermal gap 10mil

### Footprints (pad centres in the part's own frame; a part is rotated, then mirrored left to right if it is on the bottom)
0402-CAP = smd 0.7 x 0.7: 1 -0.65,0; 2 0.65,0
0603-CAP = smd 1.1 x 1: 1 -0.85,0; 2 0.85,0
0805 = smd 1 x 1.4: 1 -1,0; 2 1,0
CAP-5-2 = drill 0.7 pad 1.5 square: 1 1,0 | drill 0.7 pad 1.5: 2 -1,0
HOLE_22AWG = drill 1.016: P 0,0
ATX24_RIGHT_ANGLE = drill 1.8 pad 2.9: 1 23.1,4.76; 2 18.9,4.76; 3 14.7,4.76; 4 10.5,4.76; 5 6.3,4.76; 6 2.1,4.76; 7 -2.1,4.76; 8 -6.3,4.76; 9 -10.5,4.76; 10 -14.7,4.76; 11 -18.9,4.76; 12 -23.1,4.76; 13 23.1,10.26; 14 18.9,10.26; 15 14.7,10.26; 16 10.5,10.26; 17 6.3,10.26; 18 2.1,10.26; 19 -2.1,10.26; 20 -6.3,10.26; 21 -10.5,10.26; 22 -14.7,10.26; 23 -18.9,10.26; 24 -23.1,10.26 | hole 3: -23.1,-2.54; 23.1,-2.54
POWER_JACK_PTH = drill 2.997 pad 4.318: GND 0,7.7; GNDBREAK 4.7,10.7; PWR 0,13.7
USB-MICRO = smd 0.35 x 1.4: D+ 0,2.65; D- -0.65,2.65; GND 1.3,2.65; ID 0.65,2.65; VBUS -1.3,2.65 | smd 1.8 x 1.9: MT1 -4,0; MT2 4,0 | smd 1.9 x 1.9: P$1 -1.27,0; P$2 1.27,0
USB-A-SOCKET-TH = drill 0.92 pad 1.6: D+ 2.71,-1; D- 2.71,1; GND 2.71,-3.5; VBUS 2.71,3.5 | drill 2.3: S1 0,-6.57; S2 0,6.57
NR60XX = smd 2.2 x 5.7: P$1 2.6,0; P$2 -2.6,0
0603_LED = smd 0.8 x 1.003: A 0,-0.852; C 0,0.852
SOT23-3 = smd 0.8 x 0.9: 1 -0.95,-1; 2 0.95,-1; 3 0,1.1
0603-RES = smd 1.1 x 1: 1 -0.85,0; 2 0.85,0
TRACE-CUT = smd 0.5 x 0.6: L1 -0.65,0; R1 0.65,0
SOLDER-BRIDGE-OPEN-LARGE = smd 0.9 x 1: L1 -0.95,0; R1 0.95,0 | smd 0.6 x 0.35: L2 -0.2,0.325; R2 0.2,-0.325
PUSHBUTTON-2.5-5.4 = drill 0.9: 1 -2.5,2.7; 2 0,2.7; 3 2.5,2.7; 4 -2.5,-2.7; 5 0,-2.7; 6 2.5,-2.7
TACTILE-PTH = drill 1.016 pad 1.88: 1 -3.251,2.261; 2 3.251,2.261; 3 -3.251,-2.261; 4 3.251,-2.261
CVN-V1-CONN = drill 0.7 pad 1.27 square: A1 -11.5,1.25 | drill 0.7 pad 1.27: A2 -10.5,3.25; A3 -9.5,1.25; A4 -8.5,3.25; A5 -7.5,1.25; A6 -6.5,3.25; A7 -5.5,1.25; A8 -4.5,3.25; A9 -3.5,1.25; A10 -2.5,3.25; A11 -1.5,1.25; A12 1.5,3.25; A13 2.5,1.25; A14 3.5,3.25; A15 4.5,1.25; A16 5.5,3.25; A17 6.5,1.25; A18 7.5,3.25; A19 8.5,1.25; A20 9.5,3.25; A21 10.5,1.25; A22 11.5,3.25; A23 12.5,1.25; A24 13.5,3.25; A25 14.5,1.25; A26 15.5,3.25; A27 16.5,1.25; A28 17.5,3.25; A29 18.5,1.25; A30 19.5,3.25; A31 20.5,1.25; A32 21.5,3.25; A33 22.5,1.25; A34 23.5,3.25; A35 24.5,1.25; A36 25.5,3.25; A37 26.5,1.25; A38 27.5,3.25; A39 28.5,1.25; A40 29.5,3.25; A41 30.5,1.25; A42 31.5,3.25; A43 32.5,1.25; A44 33.5,3.25; A45 34.5,1.25; A46 35.5,3.25; A47 36.5,1.25; A48 37.5,3.25; A49 38.5,1.25; B1 -11.5,-1.25; B2 -10.5,-3.25; B3 -9.5,-1.25; B4 -8.5,-3.25; B5 -7.5,-1.25; B6 -6.5,-3.25; B7 -5.5,-1.25; B8 -4.5,-3.25; B9 -3.5,-1.25; B10 -2.5,-3.25; B11 -1.5,-1.25; B12 1.5,-3.25; B13 2.5,-1.25; B14 3.5,-3.25; B15 4.5,-1.25; B16 5.5,-3.25; B17 6.5,-1.25; B18 7.5,-3.25; B19 8.5,-1.25; B20 9.5,-3.25; B21 10.5,-1.25; B22 11.5,-3.25; B23 12.5,-1.25; B24 13.5,-3.25; B25 14.5,-1.25; B26 15.5,-3.25; B27 16.5,-1.25; B28 17.5,-3.25; B29 18.5,-1.25; B30 19.5,-3.25; B31 20.5,-1.25; B32 21.5,-3.25; B33 22.5,-1.25; B34 23.5,-3.25; B35 24.5,-1.25; B36 25.5,-3.25; B37 26.5,-1.25; B38 27.5,-3.25; B39 28.5,-1.25; B40 29.5,-3.25; B41 30.5,-1.25; B42 31.5,-3.25; B43 32.5,-1.25; B44 33.5,-3.25; B45 34.5,-1.25; B46 35.5,-3.25; B47 36.5,-1.25; B48 37.5,-3.25; B49 38.5,-1.25 | hole 2.35: 0.15,0; 40.3,0
SOT23-5 = smd 0.55 x 1.2: 1 -0.95,-1.3; 2 0,-1.3; 3 0.95,-1.3; 4 0.95,1.3; 5 -0.95,1.3
SOT363 = smd 0.3 x 1: 1 -0.65,-0.9; 2 0,-0.9; 3 0.65,-0.9; 4 0.65,0.9; 5 0,0.9; 6 -0.65,0.9
RJ45 = drill 1 pad 1.88: 1 -4.445,6.35; 2 -3.175,8.89; 3 -1.905,6.35; 4 -0.635,8.89; 5 0.635,6.35; 6 1.905,8.89; 7 3.175,6.35; 8 4.445,8.89 | drill 0.89 pad 1.88: L1 6.325,-3.38; L2 3.785,-4.9; L3 -3.785,-3.38; L4 -6.325,-4.9 | drill 1.6: S1 -7.875,3.05; S2 7.875,3.05 | hole 3.25: -5.715,0; 5.715,0
TSSOP16 = smd 0.305 x 0.991: 1 -2.275,-2.918; 2 -1.625,-2.918; 3 -0.975,-2.918; 4 -0.325,-2.918; 5 0.325,-2.918; 6 0.975,-2.918; 7 1.625,-2.918; 8 2.275,-2.918; 9 2.275,2.918; 10 1.625,2.918; 11 0.975,2.918; 12 0.325,2.918; 13 -0.325,2.918; 14 -0.975,2.918; 15 -1.625,2.918; 16 -2.275,2.918
HTSOP8 = smd 0.61 x 2.21: 1 -1.905,-2.616; 2 -0.635,-2.616; 3 0.635,-2.616; 4 1.905,-2.616; 5 1.905,2.616; 6 0.635,2.616; 7 -0.635,2.616; 8 -1.905,2.616 | drill 1.016: P$1 0,0 | drill 0.305: P$2 -1,0.5; P$3 -1,-0.5; P$4 1,-0.5; P$5 1,0.5 | smd 3.2 x 2.4: PAD 0,0
SOT223 = smd 1.219 x 2.235: 1 -2.311,-3.099; 2 0,-3.099; 3 2.311,-3.099 | smd 3.6 x 2.2: 4 0,3.099

### Placement (x,y rotation side)
C1  69.9,4.2 0 top
C2  53.5,22.1 0 top
C3  58.2,23.4 180 top
C4  58.2,21.8 180 top
C5  12.1,21 90 top
C6  19.7,23.3 270 top
C7  44.4,24 180 top
C8  44.4,22.4 180 top
C9  17.2,23.3 270 top
C10  22.8,23.3 270 top
C11  21,23.3 270 top
C12  76,4.2 180 top
C13  84.6,7 90 top
C14  86,7 90 top
C15  72,86.5 180 top
C16  72,88.5 180 top
C17  79,86.5 0 top
C18  76.5,83.5 90 top
C19  68.5,78 180 top
C20  66,80.5 270 top
C21  70,72.5 180 top
C22  82,76.5 0 top
C23  82,74 0 top
C24  80,64 270 top
C25  80.5,59 270 top
C26  91.4,15.4 90 top
C27  91.4,12 90 top
C28  33,21 0 top
C29  52.6,11.1 90 top
CONN1  28.3,9.9 0 top
CONN2  55.5,8.5 0 top
CONN3  60.5,38 0 top
CONN4  21.5,49 0 top
CONN5  27,49 0 top
CONN6  78.4,17.9 0 top
CONN7  73.7,17.9 0 top
CONN8  97,73 0 top
CONN9  97,69 0 top
CONN10  97,65 0 top
CONN11  97,61 0 top
CONN12  3.5,39 0 top
CONN13  3.5,35 0 top
CONN14  39.37,50.8 0 top
CONN15  43.18,50.8 0 top
CONN16  53.34,50.8 0 top
CONN17  49.53,50.8 0 top
J1  38,92 180 top
J2  103,82 90 top
JP1  61,1.6 0 top
JP2  86,1.6 0 top
JP3  40.9,9 90 top
L1  81,81.5 90 top
L5VSTD  90,24 90 top
L12V  91.5,95 90 top
LPRSNT  9.5,60 90 top
LPWR_ON  72.8,23.3 0 top
LPWROK  90,22 90 top
LRESET  20,34.5 180 top
LRX  95.6,3.8 0 top
LTX  97.6,3.8 0 top
LUBOOT  34,34.5 180 top
Q1  60.7,28.1 270 top
R1  69.9,6 180 top
R2  53.5,18.9 0 top
R3  53.5,20.5 180 top
R4  14.1,20.9 90 top
R5  63.01,16.01 90 top
R6  63.4,13.3 180 top
R7  86,22 0 top
R8  60.9,34.5 0 top
R9  9.5,62 180 top
R10  49.4,18.6 90 top
R11  44.4,20.8 0 top
R12  56.5,28.9 270 top
R13  71,23.3 90 top
R14  87.5,95 0 top
R15  16,34.5 270 top
R16  18,34.5 270 top
R17  30,34.5 270 top
R18  32,34.5 270 top
R19  95.6,7.8 270 top
R20  97.6,7.8 270 top
R21  76,6 0 top
R22  82.1,10.3 90 top
R23  80.3,10.3 90 top
R24  20.5,52 180 top
R25  28,52 0 top
R26  58.2,20.2 0 top
R27  86,24 0 top
R28  78,68.5 90 top
R29  79,89.5 90 top
R30  82.5,59 90 top
R31  70,74 0 top
R32  70,76 180 top
R33  66.1,20.5 90 top
SB1  88,19.2 90 top
SB2  86.7,19.2 90 top
SB3  77,89.5 270 top
SB4  76,68.5 270 top
SB5  84.5,59 270 top
SB6  44.4,19.2 180 top
SB7  58.2,18.6 180 top
SW_ATXON  87,35 0 top
SW_PWRON  71.5,35 0 top
SW_RESET  18,40.5 0 top
SW_UBOOT  32,40.5 0 top
U$1  30.39,60.79 0 top
U$2  62,20.2 0 top
U$3  60.9,9.2 180 top
U$4  48.4,22.4 0 top
U$5  15,7 0 top
U$6  40,18.6 180 top
U$7  86.2,14.1 180 top
U$8  71.5,82 270 top
U$9  88,64 180 top

### Tracks (layer width: path | path; a pad name or v marks a point on that pad's centre or on a via)
3.3V  (via drill 0.3)
  Top 0.152: SB5.R1 84.17,58.38 SB5.R2
  Top 0.229: LPRSNT.A 10.5,59.85 v10.5,54.5 | LRESET.A 21.85,35.35 v22,35.5 | R15.2 13.85,33.65 v13.5,34 | LUBOOT.A 35.85,35.35 v36,35.5 | R17.2 28.65,33.65 v28,33 | R24.2 v18,52 | R25.2 v30.5,52 | R4.2 v14.1,22.9 | R6.2 61.7,13.3 v61,14 | Q1.2 58.65,27.15 v58.2,27.6 57.75,28.05 R12.2 | U$7.10 84.58,12.47 v84.6,12.5 | U$7.12 85.88,12.47 v85.9,12.5 | U$7.3 87.17,15.82 v87.2,15.8 | C26.1 90.25,14.55 v90.2,14.5 | C27.1 90.45,11.35 v90.3,11.5 | LRX.A 95.55,3 v93.9,3 | LTX.A 97.65,2.9 v98.9,2.9
  Top 1.016: R30.1 82.5,57.5 83.5,57.5 | 83.5,57.5 84.5,57.5 SB5.R1 | 83.5,57.5 83.5,57 | CONN10.P 93.5,61.5 93.5,59 90.5,56 83.5,56
  Top 1.626: 83.5,57 83.5,56 83.5,55.5 | 83.5,55.5 v83.5,54.5 | v83.5,54.5 v82.5,54.5 v82.5,55.5 | 83.5,55.5 v84.5,55.5 v84.5,54.5 v83.5,54.5
  pour Route15 (isolate 0.305): -4,-4 104,-4 104,56 46,56 46,60.5 26.5,60.5 26.5,56 -4,56
3.3V_U
  Top 0.152: C25.1 80.5,60.9 | R30.2 82.5,60.9 | SB5.L2 84.83,59.62 SB5.L1 84.5,60.9
  Top 1.016: U$9.2 U$9.4
  Top 1.626: J1.2 J1.1 J1.13 14.9,80.1 18,77 56,77 66,67 72,67 78.1,60.9 80.5,60.9 82.5,60.9 84.5,60.9 U$9.4
  Bottom 1.626: J1.12 61.1,88.9 56.5,93.5 23.5,93.5 19.1,89.1 J1.2
5V  (via drill 0.3)
  Top 0.152: SB4.R2 75.67,67.88 SB4.R1 76.45,67.1 | R28.1 78,67.1 | 53.2,27.6 53.2,28.1 53.5,28.4 53.8,28.1 53.8,27.6 | v70.9,51.7 71.1,51.5 71.1,51.3 71.4,51.3 v71.6,51.1 | v80,67.1 80,67
  Top 0.61: C7.1 45.55,23.7 U$4.5 U$4.4 53.2,27.55 53.2,27.6 53.2,28.2 | U$2.5 61.05,22.65 60.3,23.4 C3.1 59.05,24.75 57.6,26.2 55.1,26.2 53.8,27.5 53.8,27.6 53.8,28.2
  Top 1.016: C24.1 80,67 v80,67.1 | CONN9.P 94.5,71.5 89,71.5 85.69,68.19 U$9.3
  Top 1.626: 76.45,67.1 78,67.1 v80,67.1 U$9.3 | v80,67.1 v80.8,67.1 v81.6,67.1 | 53.5,28.4 53.5,37.5 58.5,42.5 62.3,42.5 v70.6,50.8 71.1,51.3
  Route15 1.626: v80,67.1 75.9,63 75.9,56.1 v70.6,50.8
5V_U
  Top 0.152: R31.2 70.65,73.8 C21.1 70.5,72.35 70.5,70.5 | 80.5,79 80.6,78.9 L1.P$2 | SB4.L1 76.33,69.12 SB4.L2 76,69.03 76,70.5 | 78,70.5 R28.2
  Top 1.016: L1.P$2 C22.1 C23.1
  Top 1.626: J1.4 27.5,86 29,84.5 36,84.5 | 36,84.5 46,84.5 48.5,82 J1.21 J1.22 J1.23 68.14,70.5 70.5,70.5 76,70.5 78,70.5 80.5,73 80.5,79 | J1.6 36,87.14 36,84.5
12V  (via drill 0.3)
  Top 0.152: SB3.R2 76.67,88.88 SB3.R1 | L12V.A v94,95 | U$8.1 69.98,85 74.5,85
  Top 0.61: 74.5,84.5 74.5,84.29 U$8.8 | 76.5,87 77,86.5 C17.1
  Top 1.016: C15.1 v74.5,86.5 | v74.5,86.5 v76,86.5 76.5,87 v77,87.5 77,88 | 77,88 SB3.R1 | C16.1 74,88.5 v74.5,88 77,88 | 77,88 79,88 | 79,88 R29.1 | 79,88 v80,88 | v74.5,86.5 74.5,85 74.5,84.5
  pour Route15 (isolate 0.305, rank 2): -4,56 104,56 104,104 -4,104
12V_U
  Top 0.152: SB3.L2 77.33,90.12 | 77.33,90.12 SB3.L1 77,91 | R29.2 79,92 | 77.33,90.12 77.33,91.67 77,92
  Top 3.048: J2.PWR 89.3,83.7 81,92 79,92 77,92 66.5,92 65.37,90.87 56.9,90.87 | J1.11 56.9,90.87 | J1.10 56.33,90.87 56.9,90.87
!RXLED
  Top 0.229: U$7.14 87.17,10.22 88.75,8.65 R19.1
!TXLED
  Top 0.229: U$7.7 84.58,14.62 85.6,13.6 94.6,13.6 97.6,10.6 R20.1
COM_RX
  Top 0.229: SB1.R1 88,20.3 87.5,20.8 79.8,20.8 78.4,19.4 CONN6.P
  Bottom 0.229: U$1.A7 24.89,64.59 26.7,66.4 69.8,66.4 73.5,62.7 73.5,55.5 79.3,49.7 79.3,18.8 CONN6.P
COM_TX
  Top 0.229: SB2.R1 82.95,19.85 79.7,16.6 75,16.6 CONN7.P
  Bottom 0.229: U$1.A8 27.45,65.6 69.7,65.6 72.7,62.6 72.7,54.9 78.4,49.2 78.4,22.6 CONN7.P
ETH_RXN
  Top 0.229: U$1.B44 64.6,56.83 64.6,56.3 64.2,55.9 62.5,55.9 35,28.4 21.7,28.4 18.7,25.4 18.7,24 | 18.7,24 18.7,17.8 19.2,17.3 19.9,17.3 20.7,16.5 20.7,15.8 20.5,15.6 19.73,15.6 U$5.8 | C6.1 18.75,23.95 18.7,24
ETH_RXP
  Top 0.229: U$1.B43 62.89,56.89 34.9,28.9 21.5,28.9 18.2,25.6 18.2,23.9 | 18.2,23.9 18.2,13.38 U$5.7 | C9.1 18.15,23.95 18.2,23.9
ETH_TXN  (via drill 0.3)
  Top 0.229: U$1.B48 67.89,57.51 68.6,56.8 68.6,56.3 68.3,56 66.6,56 37.3,26.7 23.3,26.7 v22.2,25.6 22.8,25 C10.1
  Bottom 0.229: v22.2,25.6 22.2,24.1 15.5,17.4 11.1,17.4 10.6,16.9 10.6,15.1 10.8,14.9 11.4,14.9 11.82,15.32 U$5.2
ETH_TXP  (via drill 0.3)
  Top 0.229: U$1.B47 66.89,56.89 37.2,27.2 22.8,27.2 v22.1,26.5 21,25.4 C11.1
  Bottom 0.229: v22.1,26.5 22,26.5 21.5,26 21.5,24.1 15.2,17.8 10.8,17.8 10.2,17.2 10.2,13.71 U$5.1
FT230X_DM
  Top 0.229: JP2.D- 85.35,5.6 C13.1 81.85,6.35 80.3,7.9 R23.1
FT230X_DP
  Top 0.229: JP2.D+ C14.1 86,6.5 85.5,7 83,7 82.1,7.9 R22.1
GND  (via drill 0.3)
  Top 0.152: R14.1 v85,95 | R32.1 v72.5,76 | v56.1,21.9 55.9,22.1 C2.2 54.15,20.7 R3.1 | R33.1 v66.1,18.4
  Top 0.229: C9.2 v17.2,21.8 | C11.2 v21,21.5 | C10.2 v22.8,21.5 | C6.2 19.7,21.3 v20,21 | C5.2 v12.1,22.6 | U$6.2 40,20.5 v39.7,20.8 | U$3.2 60.9,12 v60.4,12.5 | JP1.GND 62.3,5 v63,5.7 | U$4.2 48.4,19.9 v48.1,19.6 | R10.1 48.15,17.75 v48.1,17.8 | U$2.2 62,17.5 v61.7,17.2 | R5.1 61.94,15.16 v61.9,15.2 | LPWR_ON.C 72.85,24.2 v74,24.2 | C12.2 75.15,4.4 R21.1 75.1,6.05 v75.1,7.2 | C1.2 70.75,4.4 R1.1 70.8,6.05 v70.8,7.2 | U$7.6 85.22,15.82 v85.2,15.8 | U$7.5 85.88,16.02 v86,15.9 | C26.2 90.35,16.25 v90.3,16.3 | C27.2 90.45,12.65 v90.3,12.8 | U$7.13 86.53,12.03 v86.9,12.4 | C14.2 v86,8.6 | C13.2 v84.6,8.6 | JP2.GND v87.3,5.8 | R7.1 v83.7,22 | R27.1 v83.7,24
  Top 0.305: C20.2 v66,78 C19.2
  Top 0.381: C29.2 52.6,12.9 v52.2,13.3
  Top 0.61: C17.2 v81,86.5 | C8.2 v42.2,22.4 | C7.2 v42.2,24 | C3.2 v56,23.4 | C4.2 57.25,21.9 v56.1,21.9
  Top 0.914: U$8.5 74,79.98 v74,78
  Top 1.016: C15.2 v69.5,86.5 | C16.2 v69.5,88.5 | C22.2 v84.5,76.5 | C23.2 v84.5,74 | C24.2 v81.5,63 | U$9.1 90.26,67.15 v90.26,69.19 | C25.2 v80.5,56.5
  pour Route2 (isolate 0.305): -2,102 102,102 102,-2 -2,-2
  pour Top (isolate 0.305): 60,106 106,106 106,54 73.65,54 60,67.65
HOST_DM  (via drill 0.3)
  Top 0.229: JP3.D- 39.9,13 40.1,13.2 40.1,15 39.35,15.75 U$6.4 39.35,18.15 38.4,19.1 38.4,20 39,20.6 39,21.9 37.8,23.1 v37.8,23.6
  Bottom 0.229: U$1.B10 27.1,56.75 27.1,56.3 27.5,55.9 28.2,55.9 28.9,56.6 29.9,56.6 38,48.5 38,23.8 v37.8,23.6
HOST_DP  (via drill 0.3)
  Top 0.229: v38.7,23.6 38.7,23 41.2,20.5 41.2,18.8 40.65,18.25 U$6.6 40.65,12.96 JP3.D+
  Bottom 0.229: U$1.B9 27.83,58.6 28.6,58.6 38.5,48.7 38.5,23.8 v38.7,23.6
HOST_VBUS  (via drill 0.3)
  Top 0.152: SB6.R2 43.77,19.52 SB6.R1
  Top 0.229: U$6.5 v40,16.5
  Top 0.61: R11.1 43.55,19.3 SB6.R1 43.45,17.45 v42.6,16.6
  Bottom 0.61: 38.72,15.22 37.4,13.9 JP3.VBUS 30.11,11.71 CONN1.P | 38.72,15.22 v40,16.5 42.5,16.5 v42.6,16.6 | 38.72,15.22 34,19.95 C28.1
HOST_VBUS_U
  Top 0.152: SB6.L2 45.02,18.88 SB6.L1
  Top 0.61: C8.1 R11.2 45.35,20.7 | 45.35,20.7 SB6.L1 | 45.35,20.7 45.75,21.1 U$4.1
I2C_SCL
  Top 0.229: U$1.B5 22.89,53.54 R24.1 21.35,49.15 CONN4.P
I2C_SDA
  Top 0.229: U$1.B6 23.89,53.11 25,52 R25.1 27.15,49.15 CONN5.P
N$1
  Bottom 0.229: J1.16 36.24,73 64,73 64.5,73 74.5,63 74.5,60 87,47.5 SW_ATXON.2
N$2  (via drill 0.3)
  Top 0.229: v93.2,29.8 95,28 95,24.3 92.7,22 LPWROK.A
  Bottom 0.229: J1.8 47.54,84 49.5,84 50.74,82.76 50.74,78.64 54.38,75 65,75 83,57 85.5,57 90.5,52 90.5,43 93.2,40.3 v93.2,29.8
N$3
  Top 0.229: JP1.MT1 JP1.P$1 JP1.P$2 JP1.MT2 66.65,1.6 C1.1 69.05,4.4 R1.2
N$4
  Top 0.229: U$5.3 13.1,17.48 | 13.1,17.48 13.1,18.46 | 13.1,18.46 13.1,18.7 12.1,19.7 C5.1 | 13.1,18.46 14.1,19.46 R4.1 | 13.1,17.48 15.31,17.48 U$5.6
N$6
  Top 0.229: U$2.3 62.95,16.92 R5.2
N$8
  Top 0.229: R13.2 65.45,24.15 61.8,27.8 Q1.3
N$9
  Top 0.229: R7.2 LPWROK.C
N$10
  Top 0.229: R19.2 LRX.C
N$11
  Top 0.229: R20.2 LTX.C
N$12
  Top 0.229: U$4.3 49.4,21.05 R10.2
N$14
  Top 0.229: R9.2 LPRSNT.C
N$15
  Top 0.229: LPWR_ON.A R13.1
N$16
  Top 0.229: LRESET.C R16.2
N$17
  Top 0.152: R14.2 L12V.C
N$18
  Top 0.229: R18.2 LUBOOT.C
N$19
  Top 0.229: R23.2 81.15,10.3 83.04,10.3 U$7.9
N$20
  Top 0.229: JP2.MT2 JP2.P$2 JP2.P$1 JP2.MT1 79.25,1.6 C12.1 76.85,4.4 R21.2
N$21
  Top 0.229: SB1.L1 88.47,18.07 U$7.1
N$22
  Top 0.229: SB2.L1 86.53,18.38 U$7.4
N$23
  Top 0.229: R22.2 82.1,15.19 U$7.8
N$24
  Top 0.229: L5VSTD.C R27.2
N$25  (via drill 0.3)
  Top 0.229: v93.8,26.3 91.5,24 L5VSTD.A
  Bottom 0.229: J1.9 51.24,84.5 64.5,84.5 71.5,77.5 72.5,77.5 94.5,55.5 94.5,27 v93.8,26.3
N$26
  Top 0.61: U$8.7 76.28,82.64 C18.1
N$27
  Top 0.61: C18.2 80.15,84.15 80.95,84.15 L1.P$1
  Top 0.914: U$8.6 77.36,81.36 80.15,84.15
N$28
  Top 0.305: U$8.3 C20.1
N$29
  Top 0.305: U$8.4 69.15,79.83 C19.1
N$30
  Top 0.152: U$8.2 64.64,82.64 64,82 64,78 66,76 R32.2 R31.1 69.15,72.7 C21.2
OTG_DM  (via drill 0.3)
  Top 0.229: v58.6,9.6 59.9,8.3 U$3.4 60.25,6.55 60.35,6.45 JP1.D-
  Bottom 0.229: U$1.B20 38.6,56.25 38.6,55.4 39.1,54.9 39.6,54.9 40.15,55.45 41.05,55.45 47.9,48.6 47.9,20.9 57.4,11.4 60.6,11.4 61.1,10.9 61.1,10.3 60.4,9.6 v58.6,9.6
OTG_DP  (via drill 0.3)
  Top 0.229: v63.8,10.9 63.8,10.55 U$3.6 61.55,6.75 61,6.2 JP1.D+
  Bottom 0.229: U$1.B19 39.83,58.6 40.4,58.6 40.94,58.06 40.94,56.26 48.4,48.8 48.4,21.1 57.6,11.9 62.8,11.9 v63.8,10.9
OTG_IDDET  (via drill 0.3)
  Top 0.229: JP1.ID 61.65,5.85 64.6,8.8 64.6,11.5 64.2,11.9 64,11.9 | 64,11.9 62.6,11.9 61.9,11.2 | 61.9,11.2 61.55,10.85 U$3.1 | R6.1 64.25,12.15 64,11.9 | 61.9,11.2 v62.2,10.9
  Bottom 0.229: U$1.B16 35.89,55.21 37.3,53.8 39,53.8 41.1,51.7 41.1,31.3 44.9,27.5 44.9,19.8 48.4,16.3 51.5,16.3 52.8,15 52.8,14.3 59,8.1 60.9,8.1 62.2,9.4 v62.2,10.9
OTG_VBUS
  Top 0.152: SB7.R2 57.58,18.93 SB7.R1 56.95,18.9 R2.2
  Top 0.305: U$3.5 60.9,9 60.7,9.2 59.9,9.2 59.5,9.6 59.5,10.1 59.1,10.5 57.5,10.5 57.3,10.3 | 56.4,9.4 CONN2.P
  Top 0.381: JP1.VBUS 59.7,6.1 56.4,9.4 57.3,10.3 57.25,10.35 SB7.R1 | CONN2.P 53.9,10.1 C29.1
  Top 0.61: R26.1 57.25,20.1 SB7.R1
OTG_VBUS_U
  Top 0.152: SB7.L1 58.83,18.27 SB7.L2
  Top 0.61: U$2.1 59.45,18.9 SB7.L1 59.15,20.1 R26.2 C4.1
OTG_VBUSDET  (via drill 0.3)
  Top 0.152: R2.1 R3.2 52.85,20.7 C2.1
  Top 0.229: R2.1 52.65,16.65 v51.4,15.4
  Bottom 0.229: U$1.B15 34.89,55.51 37.1,53.3 38.8,53.3 40.6,51.5 40.6,31.1 44.4,27.3 44.4,19.5 49.1,14.8 50.8,14.8 v51.4,15.4
OTG_VBUSDRV  (via drill 0.3)
  Top 0.152: R33.2 65.75,21.7 v64.1,21.7
  Top 0.229: U$2.4 63.15,21.7 v64.1,21.7
  Bottom 0.229: U$1.A14 34.93,63 41.4,63 41.9,62.5 41.9,58.9 42.9,57.9 42.9,55.8 58.1,40.6 58.1,34.9 64.1,28.9 v64.1,21.7
PRSNT#  (via drill 0.3)
  Top 0.229: U$1.A1 18.85,62 10.6,62 | 10.6,62 R9.1 | 10.35,62.25 10.6,62 | v51.7,67.2 52.9,66 52.9,63.5 53.9,62.5 53.9,59 54.9,58 54.9,56.2 v57.6,53.5 | R8.2 61.85,34.4 v63.3,34.4
  Bottom 0.229: U$1.A1 18.4,62.53 18.4,65.5 20.1,67.2 v51.7,67.2 | v57.6,53.5 63.3,47.8 v63.3,34.4
PWR_ON#  (via drill 0.3)
  Top 0.229: R12.1 59,29.75 | 59,29.75 Q1.1 | 59,29.75 59,30.4 | 59,30.4 59,33.45 R8.1 60.05,37.55 CONN3.P | SW_PWRON.5 69.6,30.4 59,30.4 | U$1.B8 26.85,58.5 33.4,58.5 33.9,59 33.9,60 34.4,60.5 49.6,60.5 49.9,60.2 49.9,59 50.9,58 50.9,56.8 55.6,52.1 v55.7,52.1
  Bottom 0.229: v55.7,52.1 60.5,47.3 CONN3.P
SPI0_CLK
  Top 0.229: U$1.B27 47.83,58.6 48.4,58.6 48.9,58.1 48.9,56.6 53.34,52.16 CONN16.P
SPI0_CS
  Top 0.229: U$1.B28 47.89,52.44 CONN17.P
SPI0_MISO
  Top 0.229: U$1.B24 43.89,51.51 CONN15.P
SPI0_MOSI
  Top 0.229: U$1.B23 42.89,54.32 CONN14.P
SYS_RESET#
  Top 0.229: R16.1 R15.1 16,36.99 SW_RESET.3 13.99,39 12.5,39 | 12.5,39 CONN12.P | 12.5,39 12.5,58.15 15.16,60.81 27.62,60.81 U$1.B11
UBOOT
  Top 0.229: R17.1 R18.1 | R17.1 30,36.99 SW_UBOOT.3 | R17.1 27.85,35.35 24.5,32 6.5,32 CONN13.P 1.5,37 1.5,60.5 9.5,68.5 27,68.5 30,65.5 30,63.5 31,62.5 32.43,62.5 U$1.A13

### Text on the board
tPlace: 12V | 12V only! | PRESENT | Coven test socket / v1 7-3-14 | RESET | UBOOT | CARD VREGS | ATX POWER | AVAIL | PGOOD | RX | TX | OTG | UART